# Altium schematic sheet MT25QL256_QSPI_NOR_Flash.SchDoc: Quad SPI Flash Memory
size A4
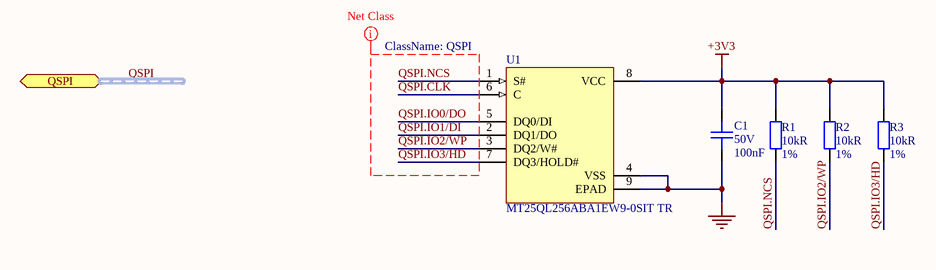
[diagram p0: MT25QL256_QSPI_NOR_Flash.SchDoc]

## Parts
C1  Voltage: 50V  Capacitance: 100nF  [C0402]  (hidden comment: CAP CER 0.1UF 50V X7R 0402)
R1  Resistance: 10kR  Tolerance: 1%  [R0402]  (hidden comment: RES SMD 10K OHM 1% 1/16W 0402)
R2  Resistance: 10kR  Tolerance: 1%  [R0402]  (hidden comment: RES SMD 10K OHM 1% 1/16W 0402)
R3  Resistance: 10kR  Tolerance: 1%  [R0402]  (hidden comment: RES SMD 10K OHM 1% 1/16W 0402)
U1  MT25QL256ABA1EW9-0SIT TR  [W-PDFN-8_8X6_P127]

## Ports
QSPI (harness QSPI)

## Nets
+3V3: C1.2 R1.1 R2.1 R3.1 U1.8(VCC)
GND: C1.1 U1.4(VSS) U1.9(EPAD)
QSPI.CLK: U1.6(C)
QSPI.IO0/DO: U1.5(DQ0/DI)
QSPI.IO1/DI: U1.2(DQ1/DO)
QSPI.IO2/WP: R2.2 U1.3(DQ2/W#)
QSPI.IO3/HD: R3.2 U1.7(DQ3/HOLD#)
QSPI.NCS: R1.2 U1.1(S#)

## Buses and harness runs
harness QSPI = port QSPI

## Layout directives
net class QSPI: QSPI.CLK, QSPI.IO0/DO, QSPI.IO1/DI, QSPI.IO2/WP, QSPI.IO3/HD, QSPI.NCS

## Notes on the sheet
- Title
- Size:
- Date:
- A4
- Number:
- Time:
- Revision:
- Sheet
- of
- File:

## Library data of the parts
C1 = CAP CER 0.1UF 50V X7R 0402: 0.1µF ±10% 50V Ceramic Capacitor X7R 0402 (1005 Metric); Manufacturer Part Number: CGA2B3X7R1H104K050BB; Manufacturer: TDK; Supplier 1: Digi-Key; Stock 1: 2925303; Pricing 1: 1=0.17, 10=0.118, 50=0.0668, 100=0.0553, 500=0.0388, 1000=0.0321, 2500=0.0299, 5000=0.0273 (USD); Mount: Surface Mount; Case Code (Metric): 1005; Case Code (Imperial): 0402; Min Operating Temperature: -55°C; Max Operating Temperature: 125°C; Tolerance: 10%; Dielectric: X7R; Voltage Rating: 50V; Voltage Rating (DC): 50V; Packaging: Tape and Reel; Package Quantity: 1; Termination: SMD/SMT; Composition: Ceramic; Length: 1mm; Height: 0.5mm; Width: 0.02inch; Thickness: 0.022inch; Depth: 0.5mm; REACH SVHC: No SVHC; Lead Free: Lead Free; ComponentLink1URL: http://product.tdk.com/capacitor/mlcc/en/documents/mlccspec_automotive_general_midvoltage_en.pdf?src-supplier=Future+Electronics; ComponentLink1Description: http://product.tdk.com/capacitor/mlcc/en/documents/mlccspec_automotive_general_midvoltage_en.pdf?src-supplier=Future+Electronics; ComponentLink2URL: http://www.farnell.com/datasheets/1807242.pdf?src-supplier=Element14; ComponentLink2Description: http://www.farnell.com/datasheets/1807242.pdf?src-supplier=Element14; ComponentLink3URL: http://www.mouser.com/ds/2/400/lcc_automotive_general_en-843974.pdf?src-supplier=Mouser; ComponentLink3Description: http://www.mouser.com/ds/2/400/lcc_automotive_general_en-843974.pdf?src-supplier=Mouser; ComponentLink4URL: http://www.farnell.com/datasheets/1936565.pdf?src-supplier=Element14; ComponentLink4Description: http://www.farnell.com/datasheets/1936565.pdf?src-supplier=Element14; ComponentLink5URL: http://www.farnell.com/datasheets/1735392.pdf?src-supplier=Element14; ComponentLink5Description: http://www.farnell.com/datasheets/1735392.pdf?src-supplier=Element14; Supplier Part Number 1: 445-6899-1-ND; Case/Package: 0402; Weight: 2.3E-05oz; Ratings: AEC-Q200
R1-R3 = RES SMD 10K OHM 1% 1/16W 0402: 10 kOhms ±1% 0.063W, 1/16W Chip Resistor 0402 (1005 Metric) Moisture Resistant Thick Film; Manufacturer Part Number: RC0402FR-0710KP; Manufacturer: Yageo; Temperature Coefficient: 150ppm/°C; Max Power Dissipation: 63mW; Supplier 1: Digi-Key; Stock 1: 839368; Pricing 1: 1=0.1, 10=0.035, 100=0.014, 1000=0.0063, 2500=0.0055, 5000=0.0045 (USD); Case Code (Imperial): 0402; Case Code (Metric): 1005; Min Operating Temperature: -55°C; Max Operating Temperature: 155°C; Composition: Thick Film; Packaging: Tape and Reel; Number of Terminations: 2; Length: 0.039inch; Height: 0.016inch; Width: 0.02inch; ComponentLink1URL: http://www.yageo.com/NewPortal/yageodocoutput?fileName=/pdf/R-Chip/PYu-RC_51_RoHS_P_0.pdf&src-supplier=Digi-Key; ComponentLink1Description: http://www.yageo.com/NewPortal/yageodocoutput?fileName=/pdf/R-Chip/PYu-RC_51_RoHS_P_0.pdf&src-supplier=Digi-Key; Supplier Part Number 1: YAG1249CT-ND; Case/Package: 0402; Features: Moisture Resistant; Mount: Surface Mount
U1 = IC MT25QL256 FLASH 256M SPI 133MHZ 8WPDFN: 256Mb, 3V, Multiple I/O Serial Flash Memory, Quad/Dual; Manufacturer: Micron Technology; Memory Type: Non-Volatile,FLASH; Frequency: 133MHz; Manufacturer Part Number: MT25QL256ABA1EW9-0SIT TR; Supplier 1: Digi-Key; Stock 1: 3545; Pricing 1: 1=3.45, 10=3.129, 25=3.0612, 50=3.0442, 100=2.7301, 250=2.72, 500=2.6198, 1000=2.4908 (USD); Mount: Surface Mount; Min Operating Temperature: -40°C; Max Operating Temperature: 85°C; Packaging: Cut Tape; Memory Size: 256Mb; ComponentLink1URL: https://www.micron.com/~/media/documents/products/data-sheet/nor-flash/serial-nor/mt25q/die-rev-a/mt25q_qljs_l_256_aba_0.pdf?src-supplier=Digi-Key; ComponentLink1Description: https://www.micron.com/~/media/documents/products/data-sheet/nor-flash/serial-nor/mt25q/die-rev-a/mt25q_qljs_l_256_aba_0.pdf?src-supplier=Digi-Key; Supplier Part Number 1: 557-1984-1-ND